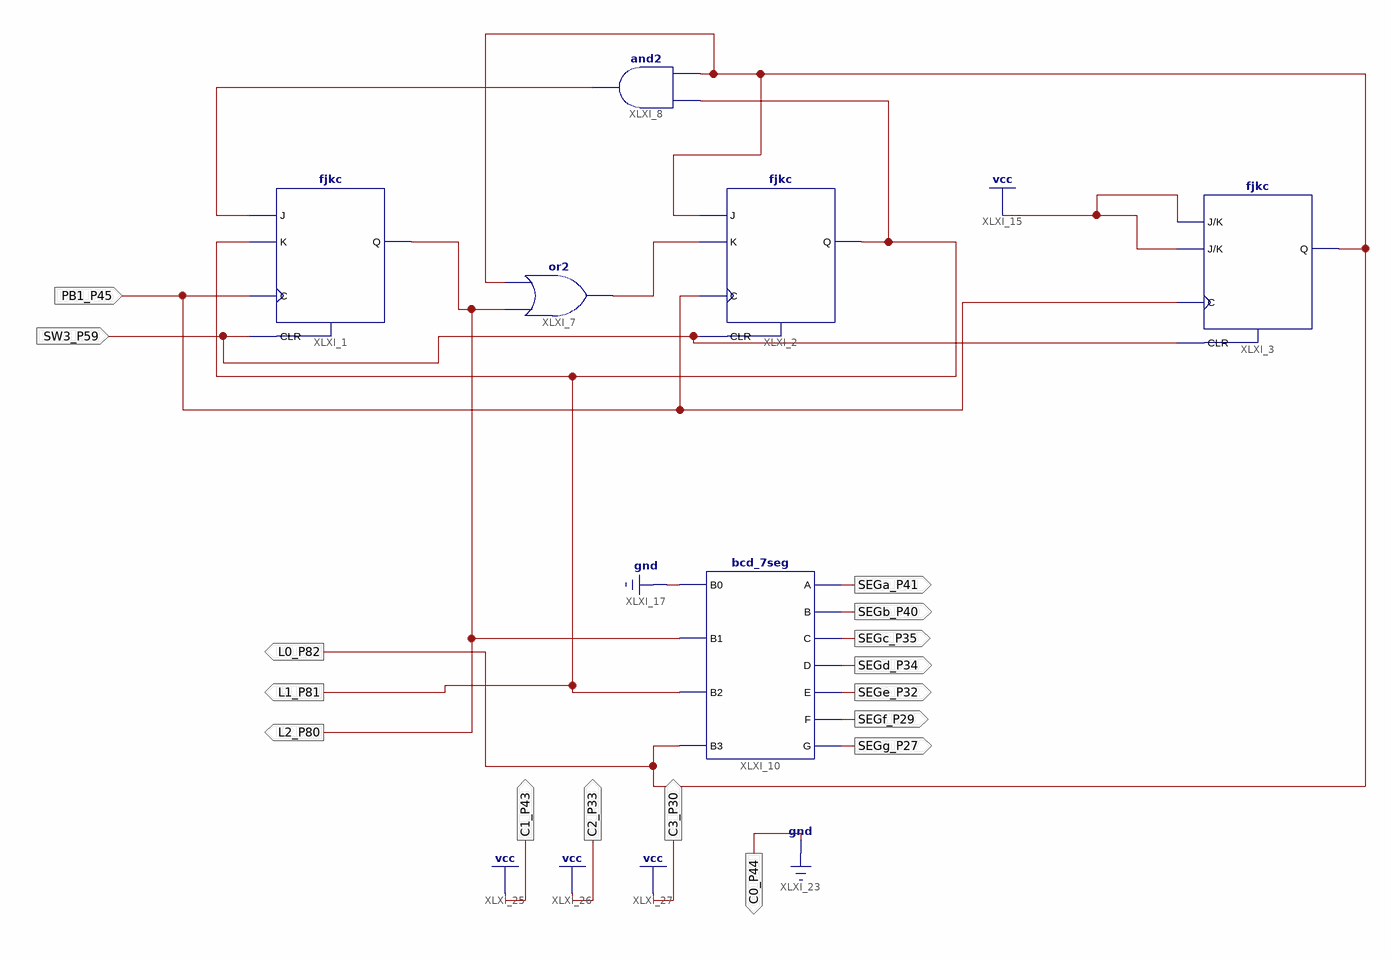
[diagram p0: schematic sheet 1]
// Xilinx ISE schematic Lab05B.sch (spartan6) as structural Verilog: 6 symbols, 16 ports
module Lab05B (
  input  PB1_P45,
  input  SW3_P59,
  output SEGa_P41,
  output SEGb_P40,
  output SEGc_P35,
  output SEGd_P34,
  output SEGe_P32,
  output SEGf_P29,
  output SEGg_P27,
  output L2_P80,
  output L1_P81,
  output L0_P82,
  output C1_P43,
  output C2_P33,
  output C3_P30,
  output C0_P44
);

  wire XLXN_6, XLXN_7;

  fjkc XLXI_1 (.C(PB1_P45), .CLR(SW3_P59), .J(XLXN_7), .K(L1_P81), .Q(L2_P80));
  fjkc XLXI_2 (.C(PB1_P45), .CLR(SW3_P59), .J(L0_P82), .K(XLXN_6), .Q(L1_P81));
  fjkc XLXI_3 (.C(PB1_P45), .CLR(SW3_P59), .J(1'b1), .K(1'b1), .Q(L0_P82));
  or XLXI_7 (XLXN_6, L2_P80, L0_P82);
  and XLXI_8 (XLXN_7, L1_P81, L0_P82);
  bcd_7seg XLXI_10 (
    .B0(1'b0), .B1(L2_P80), .B2(L1_P81), .B3(L0_P82), .A(SEGa_P41), .B(SEGb_P40), .C(SEGc_P35), .D(SEGd_P34),
    .E(SEGe_P32), .F(SEGf_P29), .G(SEGg_P27));

  assign C0_P44 = 1'b0;
  assign C1_P43 = 1'b1;
  assign C2_P33 = 1'b1;
  assign C3_P30 = 1'b1;
endmodule
